# Altium project B100.PrjPcb (part 2 of 3)

## Sheet GSM LED Indicators.SchDoc: GSM Modem Signal Indicator LED's
size A3; ApprovedBy: Mehmet Günce Akkoyun; CheckedBy: Mehmet Günce Akkoyun; Author: Mehmet Günce Akkoyun; CompanyName: Ovoo Electronics; DrawnBy: Mehmet Günce Akkoyun; Engineer: Mehmet Günce Akkoyun; Organization: Ovoo Electronics; Address1: Necip Fazýl Mah. Ortaýrmak Sok.; Address2: Birgül Apt. No: 19/6; Address3: Meram / Konya; Address4: Turkiye; DocumentNumber: 12; Revision: R06; SheetNumber: 12; SheetTotal: 54
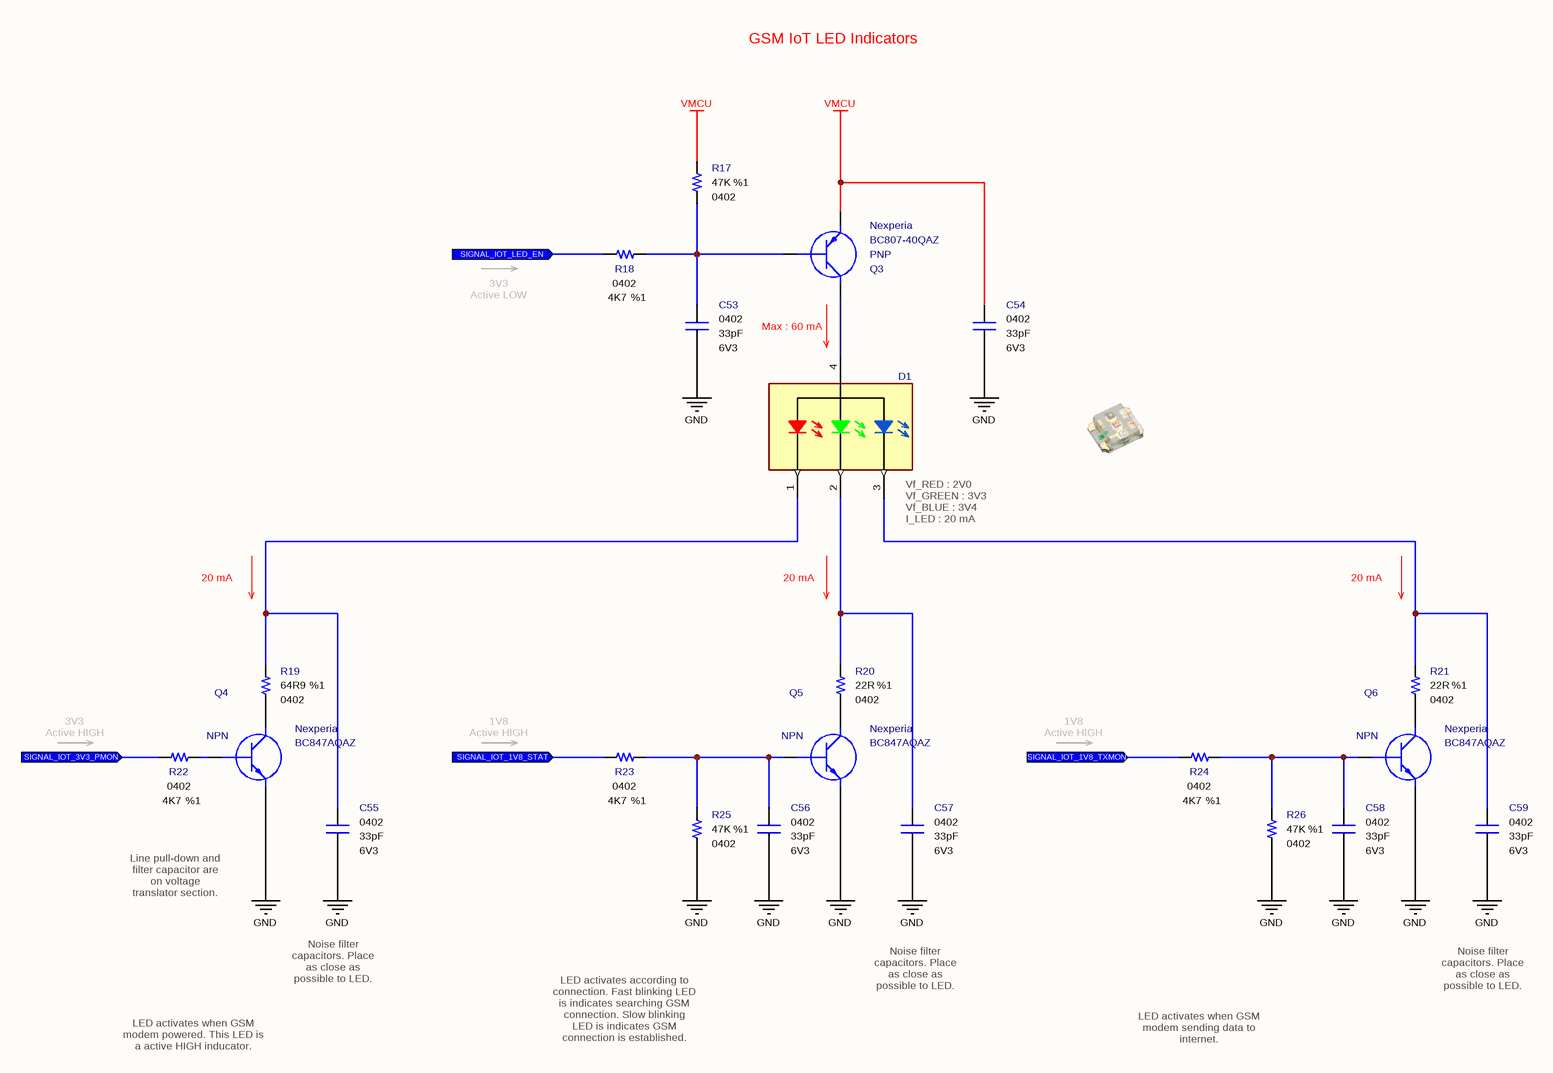
[diagram p9: GSM LED Indicators.SchDoc]

### Parts
C53  value 33pF  Case: 0402  Voltage: 6V3  [CAPACITOR_0402]  (hidden comment: Multilayer Ceramic Capacitor)
C54  value 33pF  Case: 0402  Voltage: 6V3  [CAPACITOR_0402]  (hidden comment: Multilayer Ceramic Capacitor)
C55  value 33pF  Case: 0402  Voltage: 6V3  [CAPACITOR_0402]  (hidden comment: Multilayer Ceramic Capacitor)
C56  value 33pF  Case: 0402  Voltage: 6V3  [CAPACITOR_0402]  (hidden comment: Multilayer Ceramic Capacitor)
C57  value 33pF  Case: 0402  Voltage: 6V3  [CAPACITOR_0402]  (hidden comment: Multilayer Ceramic Capacitor)
C58  value 33pF  Case: 0402  Voltage: 6V3  [CAPACITOR_0402]  (hidden comment: Multilayer Ceramic Capacitor)
C59  value 33pF  Case: 0402  Voltage: 6V3  [CAPACITOR_0402]  (hidden comment: Multilayer Ceramic Capacitor)
D1  150066M153000  [Wurth_0606]  (value not drawn)
Q3  Polarity: PNP  Manufacturer Name: Nexperia  Manufacturer Part Number: BC807-40QAZ  [SOT1215]  (hidden comment: Bipolar PNP Transistors)
Q4  Polarity: NPN  Manufacturer Name: Nexperia  Manufacturer Part Number: BC847AQAZ  [SOT1215]  (hidden comment: Bipolar NPN Transistors)
Q5  Polarity: NPN  Manufacturer Name: Nexperia  Manufacturer Part Number: BC847AQAZ  [SOT1215]  (hidden comment: Bipolar NPN Transistors)
Q6  Polarity: NPN  Manufacturer Name: Nexperia  Manufacturer Part Number: BC847AQAZ  [SOT1215]  (hidden comment: Bipolar NPN Transistors)
R17  value 47K  Tolerance: %1  Case: 0402  [RESISTOR_0402]  (hidden comment: Thick Film Resistor)
R18  value 4K7  Tolerance: %1  Case: 0402  [RESISTOR_0402]  (hidden comment: Thick Film Resistor)
R19  value 64R9  Tolerance: %1  Case: 0402  [RESISTOR_0402]  (hidden comment: Thick Film Resistor)
R20  value 22R  Tolerance: %1  Case: 0402  [RESISTOR_0402]  (hidden comment: Thick Film Resistor)
R21  value 22R  Tolerance: %1  Case: 0402  [RESISTOR_0402]  (hidden comment: Thick Film Resistor)
R22  value 4K7  Tolerance: %1  Case: 0402  [RESISTOR_0402]  (hidden comment: Thick Film Resistor)
R23  value 4K7  Tolerance: %1  Case: 0402  [RESISTOR_0402]  (hidden comment: Thick Film Resistor)
R24  value 4K7  Tolerance: %1  Case: 0402  [RESISTOR_0402]  (hidden comment: Thick Film Resistor)
R25  value 47K  Tolerance: %1  Case: 0402  [RESISTOR_0402]  (hidden comment: Thick Film Resistor)
R26  value 47K  Tolerance: %1  Case: 0402  [RESISTOR_0402]  (hidden comment: Thick Film Resistor)

### Ports
SIGNAL_IOT_1V8_STAT (in), SIGNAL_IOT_1V8_TXMON (in), SIGNAL_IOT_3V3_PMON (in), SIGNAL_IOT_LED_EN (in)

### Nets
GND: C53.2 C54.2 C55.2 C56.2 C57.2 C58.2 C59.2 Q4.2(E) Q5.2(E) Q6.2(E) R25.1 R26.1
VMCU: C54.1 Q3.2(E) R17.2
NetC53_1: C53.1 Q3.1(B) R17.1 R18.1
NetC55_1: C55.1 D1.1 R19.2
NetC56_1: C56.1 Q5.1(B) R23.1 R25.2
NetC57_1: C57.1 D1.2 R20.2
NetC58_1: C58.1 Q6.1(B) R24.1 R26.2
NetC59_1: C59.1 D1.3 R21.2
NetD1_4: D1.4 Q3.3(C)
NetQ4_1: Q4.1(B) R22.1
NetQ4_3: Q4.3(C) R19.1
NetQ5_3: Q5.3(C) R20.1
NetQ6_3: Q6.3(C) R21.1
NetR18_2: R18.2 ; port SIGNAL_IOT_LED_EN
NetR22_2: R22.2 ; port SIGNAL_IOT_3V3_PMON
NetR23_2: R23.2 ; port SIGNAL_IOT_1V8_STAT
NetR24_2: R24.2 ; port SIGNAL_IOT_1V8_TXMON

### Notes on the sheet
- GSM IoT LED Indicators
- 3V3
  Active LOW
- Max : 60 mA
- (near D1) Vf_RED : 2V0
  Vf_GREEN : 3V3
  Vf_BLUE : 3V4
  I_LED : 20 mA
- 20 mA
- 3V3
  Active HIGH
- 1V8
  Active HIGH
- Line pull-down and filter capacitor are on voltage translator section.
- Noise filter capacitors. Place as close as possible to LED.
- LED activates when GSM modem powered. This LED is a active HIGH inducator.
- LED activates according to connection. Fast blinking LED is indicates searching GSM connection. Slow blinking LED is indicates GSM connection is established.
- LED activates when GSM modem sending data to internet.
- Engineer
- All Rights are reserved to Customer and Engineer. [2021]
- Size:
- Date:
- A3
- Project :
- Time:
- Sheet
- of
- Customer
- Product ID
- Module ID
- Version
- File:
- Revision

### Library data of the parts
C53-C59 = Capacitor - 33pF [0402-6V3]: Capacitor - 33pF [0402] (Ceramic); Manufacturer Name: Kemet; Manufacturer Part Number: C0402C330J9RACAUTO; Dielectric: X7R; Tolerance: 10%; Height: 0.5mm; Maximum Operating Temperature: +125; Minimum Operating Temperature: -55; ROHS: Yes; ComponentLink1Description: DataSheet; ComponentLink1URL: https://api.kemet.com/component-edge/download/datasheet/C0402C330J9RACAUTO.pdf; ComponentLink2Description: Mouser; ComponentLink2URL: https://www.mouser.com/Search/Refine.aspx?Keyword=80-C0402C330J9RAUTO; Supplier 1: Mouser; Supplier Part Number 1: 80-C0402C330J9RAUTO; Mouser Part Number: 80-C0402C330J9RAUTO
D1 = Diode - RGB LED (150066M153000): Standard LEDs - SMD PICOLED series Red LED; Manufacturer Name: Wurth Elektronik; Datasheet Link: https://www.mouser.com.tr/datasheet/2/445/150066M153000-1715259.pdf; Manufacturer Part Number: 150066M153000; Mouser Part Number: 710-150066M153000; Mouser Price/Stock: https://www.mouser.com.tr/ProductDetail/ROHM-Semiconductor/SML-P12U2TT86R?qs=sGAEpiMZZMseGfSY3csMkRIBDsfU3UCXJTULB5gem9Ta%252Bp%252BvZ709fg%3D%3D; Case: 0606; ROHS: Yes; Supplier 1: RSComponents; Supplier 2: RSComponents; Supplier 3: Mouser; Supplier 4: Farnell; Supplier 5: Digi-Key; Supplier 6: Digi-Key; Supplier 7: Digi-Key; Supplier 8: Newark; Supplier Part Number 1: 1765006; Supplier Part Number 2: 1766050; Supplier Part Number 3: 710-150066M153000; Supplier Part Number 4: 2764964; Supplier Part Number 5: 732-11390-1-ND; Supplier Part Number 6: 732-11390-6-ND; Supplier Part Number 7: 732-11390-2-ND; Supplier Part Number 8: 22AC3253
Q3 = Transistor - BC807: Bipolar Transistors - BJT 45 V, 500 mA PNP gen purpose transistors; Mouser Part Number: 771-BC807-40QAZ; ComponentLink1Description: DataSheet; ComponentLink1URL: https://www.mouser.com.tr/datasheet/2/916/BC807-25QA_40QA-1665956.pdf; ComponentLink2Description: Mouser; ComponentLink2URL: https://www.mouser.com.tr/ProductDetail/Nexperia/BC807-40QAZ?qs=sGAEpiMZZMshyDBzk1%2FWi8mfWMj7sMzapbI3Mu1S6AqR9y7krhZTdA%3D%3D; Supplier 1: Mouser; Supplier 2: Arrow; Supplier 3: Digi-Key; Supplier 4: Digi-Key; Supplier Part Number 1: 771-BC807-40QAZ; Supplier Part Number 2: BC807-40QAZ; Supplier Part Number 3: 1727-2242-1-ND; Supplier Part Number 4: 1727-2242-6-ND; Case: DFN-1010D-3
Q4-Q6 = Transistor - BC847: Bipolar Transistors - BJT BC847AQA/DFN1010D-3/REEL 7" Q2; ComponentLink1Description: DataSheet; ComponentLink1URL: https://www.mouser.com.tr/datasheet/2/916/BC847XQA_SER-1598405.pdf; ComponentLink2Description: Mouser; ComponentLink2URL: https://www.mouser.com.tr/ProductDetail/Nexperia/BC847AQAZ?qs=%2Fha2pyFaduhKMCPKNtQimeJpXTw9z4AqURd2YARs8DVICZNv3AT9Dw%3D%3D; Case: DFN-1010D-3; Supplier 1: Mouser; Supplier 2: Digi-Key; Supplier Part Number 1: 771-BC847AQAZ; Supplier Part Number 2: 1727-2545-1-ND; Mouser Part Number: 771-BC847AQAZ
R17 R25 R26 = Resistor - 47K: Thick Film Resistors - SMD 1/16 W 47 Kohms 1%; Manufacturer Name: Vishay; Manufacturer Part Number: CRCW040247K0FKED; Height: 0.4mm; ComponentLink1Description: DataSheet; ComponentLink1URL: https://www.mouser.com.tr/datasheet/2/427/dcrcwe3-1762152.pdf; ComponentLink2Description: Mouser; ComponentLink2URL: https://www.mouser.com.tr/ProductDetail/Vishay-Dale/CRCW040247K0FKED?qs=sGAEpiMZZMu61qfTUdNhG2DpbjADlD3GL%252B3h1elTxqU%3D; Supplier 1: Mouser; Supplier 2: Digi-Key; Supplier Part Number 1: 71-CRCW040247K0FKEDH; Supplier Part Number 2: 541-47.0KYCT-ND; Mouser Part Number: 71-CRCW0402-47K-E3
R18 R22-R24 = Resistor - 4K7: Thick Film Resistors - SMD 1/16 W 4.7 Kohms 1%; Manufacturer Name: Vishay; Manufacturer Part Number: CRCW04024K70FKED; Height: 0.4mm; Mouser Part Number: 71-CRCW0402-4.7K-E3; ComponentLink1Description: DataSheet; ComponentLink1URL: https://www.mouser.com.tr/datasheet/2/427/dcrcwe3-1762152.pdf; ComponentLink2Description: Mouser; ComponentLink2URL: https://www.mouser.com.tr/ProductDetail/Vishay-Dale/CRCW04024K70FKED?qs=sGAEpiMZZMu61qfTUdNhG7nHf%2F6MTUn3HadIdDQu24Q%3D; Supplier 1: Mouser; Supplier 2: Digi-Key; Supplier Part Number 2: 541-4.70KLCT-ND; Supplier Part Number 1: 71-CRCW0402-4.7K-E3
R19 = Resistor - 64R9: Thick Film Resistors - SMD 1/16 W 64R9 Ohms 1%; Manufacturer Name: Vishay; Manufacturer Part Number: CRCW040264R9FKED; Height: 0.35mm; Mouser Part Number: 71-CRCW0402-64.9-E3; ComponentLink1Description: DataSheet; ComponentLink1URL: https://www.mouser.com.tr/datasheet/2/427/dcrcwe3-1762152.pdf; ComponentLink2Description: Mouser; ComponentLink2URL: https://www.mouser.com.tr/ProductDetail/Vishay-Dale/CRCW040264R9FKED/?qs=DKbL89i6OErClCPxVYdf6Q%3D%3D; Supplier 1: Future Electronics; Supplier 2: Future Electronics; Supplier 3: Mouser; Supplier 4: Farnell; Supplier 5: Digi-Key; Supplier 6: Digi-Key; Supplier 7: Digi-Key; Supplier 8: Newark; Supplier Part Number 1: 8103763; Supplier Part Number 2: 5785985; Supplier Part Number 3: 71-CRCW0402-64.9-E3; Supplier Part Number 4: 2140657; Supplier Part Number 5: 541-64.9LCT-ND; Supplier Part Number 6: 541-64.9LDKR-ND; Supplier Part Number 7: 541-64.9LTR-ND; Supplier Part Number 8: 27W4015
R20 R21 = Resistor - 22R: Thick Film Resistors - SMD 1/16 W 22R Ohms 1%; Manufacturer Name: Vishay; Manufacturer Part Number: CRCW040222R0FKED; Height: 0.35mm; Mouser Part Number: 71-CRCW0402-22-E3; ComponentLink1Description: DataSheet; ComponentLink1URL: https://www.mouser.com.tr/datasheet/2/427/dcrcwe3-1762152.pdf; ComponentLink2Description: Mouser; ComponentLink2URL: https://www.mouser.com.tr/ProductDetail/Vishay-Dale/CRCW040264R9FKED/?qs=DKbL89i6OErClCPxVYdf6Q%3D%3D; Supplier 1: RSComponents; Supplier 2: Avnet; Supplier 3: RSComponents; Supplier 4: Future Electronics; Supplier 5: Arrow Electronics; Supplier Part Number 1: 6788983; Supplier Part Number 2: 52K6847; Supplier Part Number 3: 6788983P; Supplier Part Number 4: 3103732; Supplier Part Number 5: CRCW040222R0FKED

## Sheet Master MicroController.SchDoc: Master Micro Controller
size A3; ApprovedBy: Mehmet Günce Akkoyun; CheckedBy: Mehmet Günce Akkoyun; Author: Mehmet Günce Akkoyun; CompanyName: Ovoo Electronics; DrawnBy: Mehmet Günce Akkoyun; Engineer: Mehmet Günce Akkoyun; Organization: Ovoo Electronics; Address1: Necip Fazýl Mah. Ortaýrmak Sok.; Address2: Birgül Apt. No: 19/6; Address3: Meram / Konya; Address4: Turkiye; DocumentNumber: 13; Revision: R06; SheetNumber: 13; SheetTotal: 54
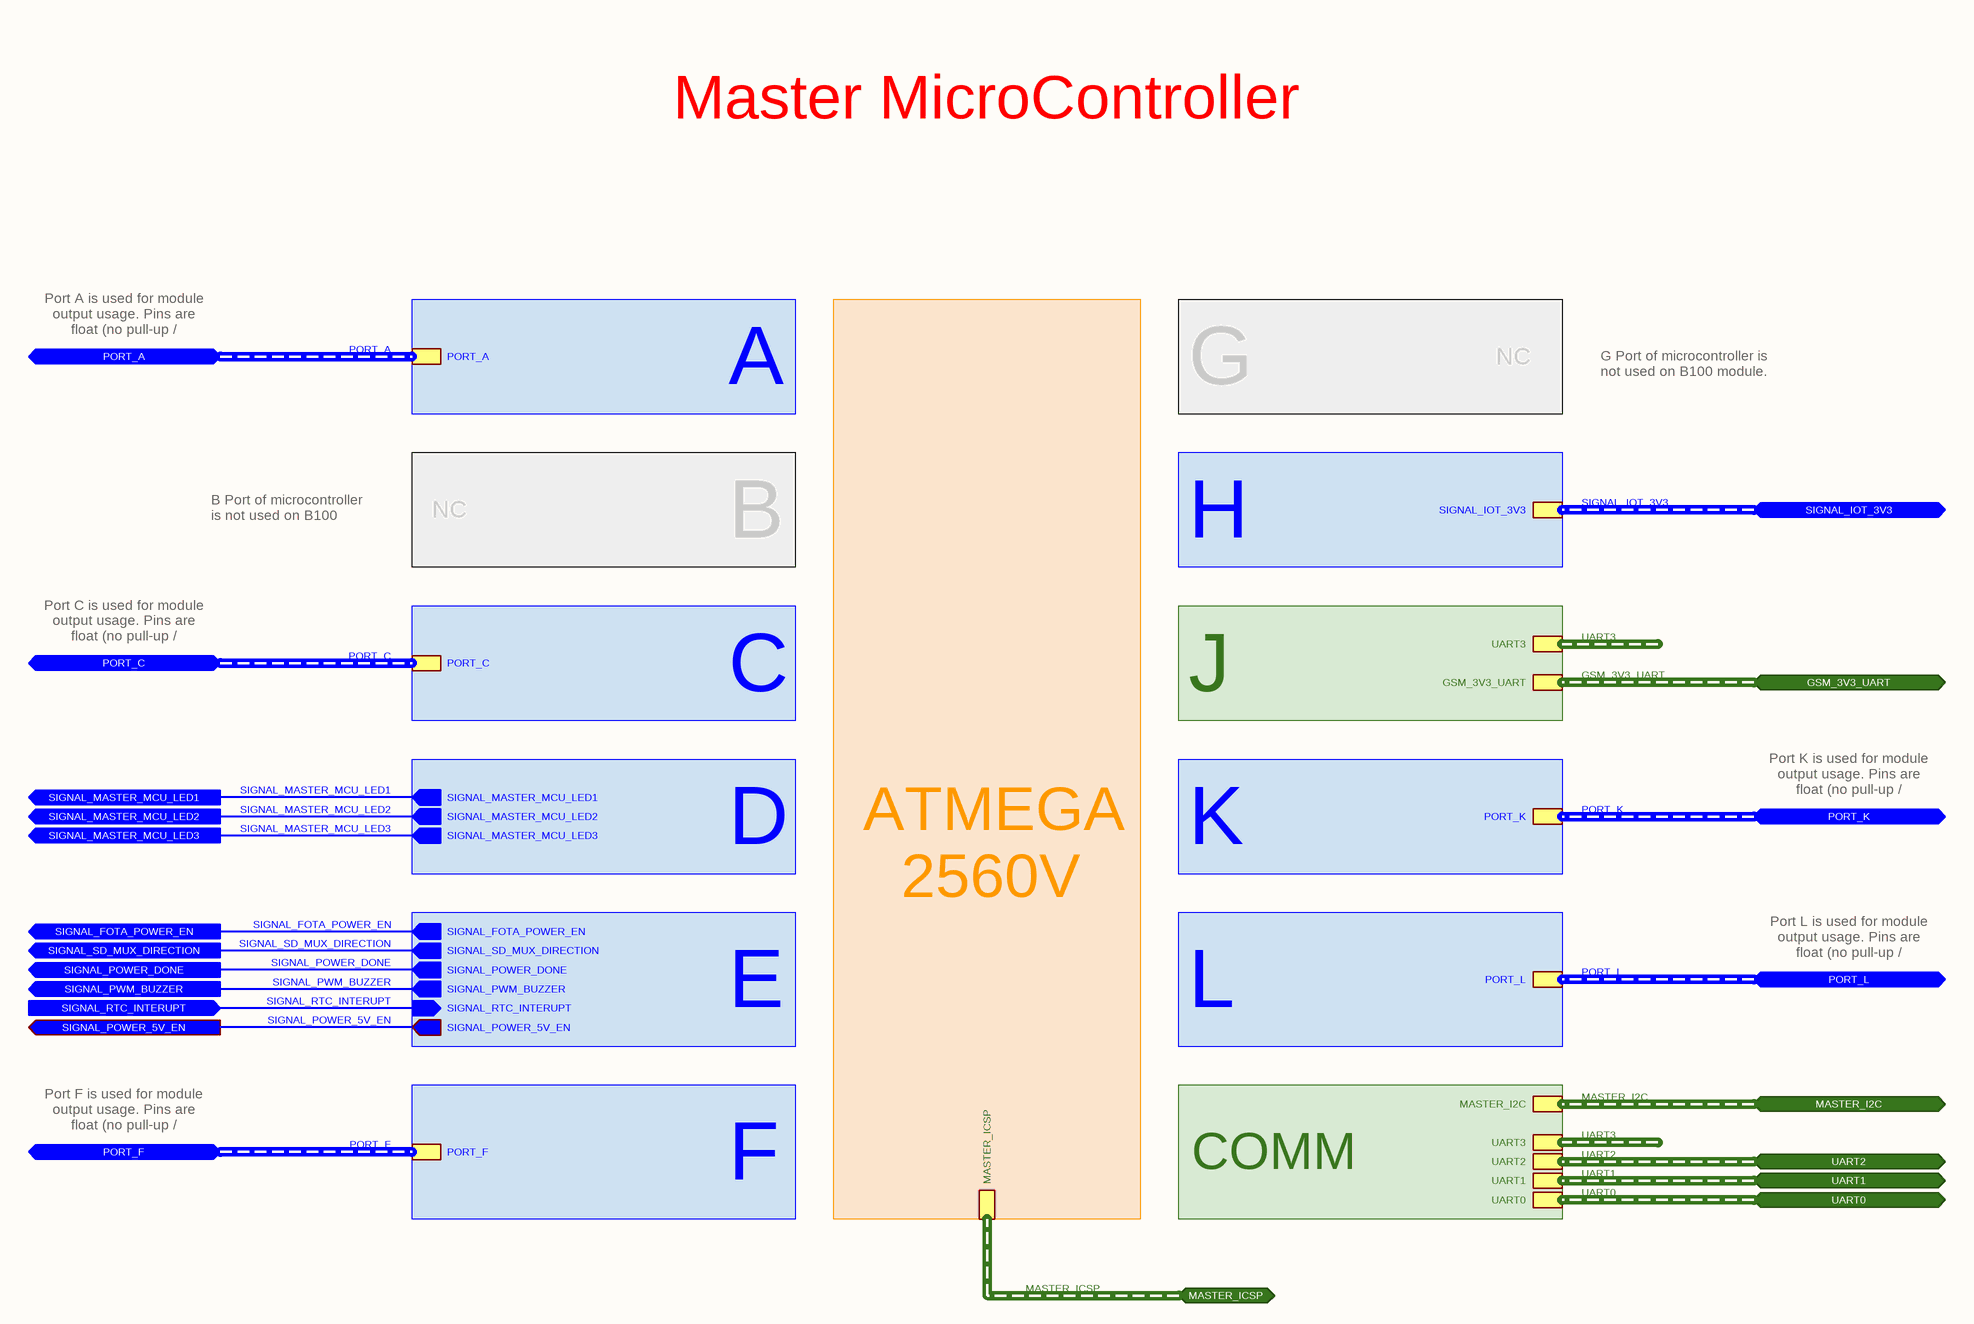
[diagram p10: Master MicroController.SchDoc]

### Sub-sheets
Master MicroController Core = Master MicroController Core.SchDoc: MASTER_ICSP (harness MASTER_ICSP)
PORT A = Master MicroController Port A.SchDoc: PORT_A (harness PORT_A)
PORT B = Master MicroController Port B.SchDoc: no entries
PORT C = Master MicroController Port C.SchDoc: PORT_C (harness PORT_C)
PORT D = Master MicroController Port D.SchDoc (file not in this document): SIGNAL_MASTER_MCU_LED1 (out), SIGNAL_MASTER_MCU_LED3 (out), SIGNAL_MASTER_MCU_LED2 (out)
PORT E = Master MicroController Port E.SchDoc: SIGNAL_FOTA_POWER_EN (out), SIGNAL_SD_MUX_DIRECTION (out), SIGNAL_PWM_BUZZER (out), SIGNAL_RTC_INTERUPT (in), SIGNAL_POWER_DONE (out), SIGNAL_POWER_5V_EN (out)
PORT F = Master MicroController Port F.SchDoc: PORT_F (harness PORT_F)
PORT G = Master MicroController Port G.SchDoc: no entries
PORT H = Master MicroController Port H.SchDoc: SIGNAL_IOT_3V3 (harness SIGNAL_IOT_3V3)
PORT J = Master MicroController Port J.SchDoc (file not in this document): GSM_3V3_UART (harness GSM_3V3_UART), UART3 (harness UART3)
PORT K = Master MicroController Port K.SchDoc: PORT_K (harness PORT_K)
PORT L = Master MicroController Port L.SchDoc (file not in this document): PORT_L (harness PORT_L)
Serial Communication = Master MicroController Serial Communication Port.SchDoc: UART3 (harness UART3), UART1 (harness UART1), UART2 (harness UART2), UART0 (harness UART0), MASTER_I2C (harness MASTER_I2C)

### Ports
GSM_3V3_UART (bidir, harness GSM_3V3_UART), MASTER_I2C (bidir, harness MASTER_I2C), MASTER_ICSP (bidir, harness MASTER_ICSP), PORT_A (bidir, harness PORT_A), PORT_C (bidir, harness PORT_C), PORT_F (bidir, harness PORT_F), PORT_K (bidir, harness PORT_K), PORT_L (bidir, harness PORT_L), SIGNAL_FOTA_POWER_EN (out), SIGNAL_IOT_3V3 (bidir, harness SIGNAL_IOT_3V3), SIGNAL_MASTER_MCU_LED1 (out), SIGNAL_MASTER_MCU_LED2 (out), SIGNAL_MASTER_MCU_LED3 (out), SIGNAL_POWER_5V_EN (out), SIGNAL_POWER_DONE (out), SIGNAL_PWM_BUZZER (out), SIGNAL_RTC_INTERUPT (in), SIGNAL_SD_MUX_DIRECTION (out), UART0 (bidir, harness UART0), UART1 (bidir, harness UART1), UART2 (bidir, harness UART2)

### Nets
SIGNAL_FOTA_POWER_EN: port SIGNAL_FOTA_POWER_EN, sheet PORT E/SIGNAL_FOTA_POWER_EN
SIGNAL_MASTER_MCU_LED1: port SIGNAL_MASTER_MCU_LED1, sheet PORT D/SIGNAL_MASTER_MCU_LED1
SIGNAL_MASTER_MCU_LED2: port SIGNAL_MASTER_MCU_LED2, sheet PORT D/SIGNAL_MASTER_MCU_LED2
SIGNAL_MASTER_MCU_LED3: port SIGNAL_MASTER_MCU_LED3, sheet PORT D/SIGNAL_MASTER_MCU_LED3
SIGNAL_POWER_5V_EN: port SIGNAL_POWER_5V_EN, sheet PORT E/SIGNAL_POWER_5V_EN
SIGNAL_POWER_DONE: port SIGNAL_POWER_DONE, sheet PORT E/SIGNAL_POWER_DONE
SIGNAL_PWM_BUZZER: port SIGNAL_PWM_BUZZER, sheet PORT E/SIGNAL_PWM_BUZZER
SIGNAL_RTC_INTERUPT: port SIGNAL_RTC_INTERUPT, sheet PORT E/SIGNAL_RTC_INTERUPT
SIGNAL_SD_MUX_DIRECTION: port SIGNAL_SD_MUX_DIRECTION, sheet PORT E/SIGNAL_SD_MUX_DIRECTION

### Buses and harness runs
harness GSM_3V3_UART = port GSM_3V3_UART = sheet PORT J/GSM_3V3_UART
harness MASTER_I2C = port MASTER_I2C = sheet Serial Communication/MASTER_I2C
harness MASTER_ICSP = port MASTER_ICSP = sheet Master MicroController Core/MASTER_ICSP
harness PORT_A = port PORT_A = sheet PORT A/PORT_A
harness PORT_C = port PORT_C = sheet PORT C/PORT_C
harness PORT_F = port PORT_F = sheet PORT F/PORT_F
harness PORT_K = port PORT_K = sheet PORT K/PORT_K
harness PORT_L = port PORT_L = sheet PORT L/PORT_L
harness SIGNAL_IOT_3V3 = port SIGNAL_IOT_3V3 = sheet PORT H/SIGNAL_IOT_3V3
harness UART0 = port UART0 = sheet Serial Communication/UART0
harness UART1 = port UART1 = sheet Serial Communication/UART1
harness UART2 = port UART2 = sheet Serial Communication/UART2
harness UART3 = sheet PORT J/UART3
harness UART3 = sheet Serial Communication/UART3

### Notes on the sheet
- Master MicroController
- Port A is used for module output usage. Pins are float (no pull-up / pull-down)
- A
- G
- NC
- G Port of microcontroller is not used on B100 module.
- B Port of microcontroller is not used on B100 module.
- B
- H
- Port C is used for module output usage. Pins are float (no pull-up / pull-down)
- C
- J
- Port K is used for module output usage. Pins are float (no pull-up / pull-down)
- D
- ATMEGA
- 2560V
- K
- Port L is used for module output usage. Pins are float (no pull-up / pull-down)
- E
- L
- Port F is used for module output usage. Pins are float (no pull-up / pull-down)
- F
- COMM
- Engineer
- All Rights are reserved to Customer and Engineer. [2021]
- Size:
- Date:
- A3
- Project :
- Time:
- Sheet
- of
- Customer
- Product ID
- Module ID
- Version
- File:
- Revision

## Sheet Master MicroController Core.SchDoc: Master MicroController Core
size A4; ApprovedBy: Mehmet Günce Akkoyun; CheckedBy: Mehmet Günce Akkoyun; Author: Mehmet Günce Akkoyun; CompanyName: Ovoo Electronics; DrawnBy: Mehmet Günce Akkoyun; Engineer: Mehmet Günce Akkoyun; Organization: Ovoo Electronics; Address1: Necip Fazýl Mah. Ortaýrmak Sok.; Address2: Birgül Apt. No: 19/6; Address3: Meram / Konya; Address4: Turkiye; DocumentNumber: 15; Revision: R06; SheetNumber: 15; SheetTotal: 54
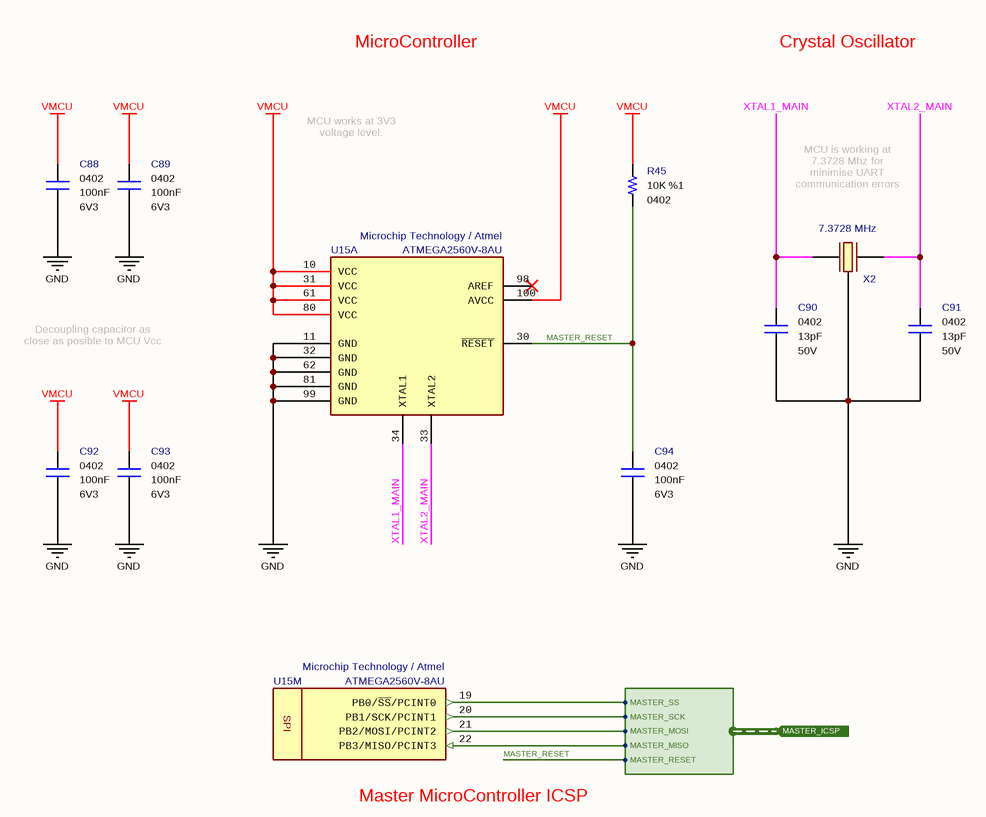
[diagram p11: Master MicroController Core.SchDoc]

### Parts
C88  value 100nF  Case: 0402  Voltage: 6V3  [CAPACITOR_0402]  (hidden comment: Multilayer Ceramic Capacitor)
C89  value 100nF  Case: 0402  Voltage: 6V3  [CAPACITOR_0402]  (hidden comment: Multilayer Ceramic Capacitor)
C90  value 13pF  Voltage: 50V  Case: 0402  [CAPACITOR_0402]  (hidden comment: Multilayer Ceramic Capacitor)
C91  value 13pF  Voltage: 50V  Case: 0402  [CAPACITOR_0402]  (hidden comment: Multilayer Ceramic Capacitor)
C92  value 100nF  Case: 0402  Voltage: 6V3  [CAPACITOR_0402]  (hidden comment: Multilayer Ceramic Capacitor)
C93  value 100nF  Case: 0402  Voltage: 6V3  [CAPACITOR_0402]  (hidden comment: Multilayer Ceramic Capacitor)
C94  value 100nF  Case: 0402  Voltage: 6V3  [CAPACITOR_0402]  (hidden comment: Multilayer Ceramic Capacitor)
R45  value 10K  Tolerance: %1  Case: 0402  [RESISTOR_0402]  (hidden comment: Thick Film Resistor)
U15  Manufacturer Part Number: ATMEGA2560V-8AU  Manufacturer Name: Microchip Technology / Atmel  [TQFP100]  (hidden comment: 8-bit MicroController)  (parts A,M of 15)
X2  7.3728 MHz  [ABRACON_CRYSTAL]

### Ports
MASTER_ICSP (in, harness MASTER_ICSP)

### Harnesses
MASTER_ICSP: MASTER_RESET, MASTER_SCK, MASTER_MISO, MASTER_MOSI, MASTER_SS

### Nets
GND: C88.1 C89.1 C90.1 C91.1 C92.1 C93.1 C94.1 U15.11(GND) U15.32(GND) U15.62(GND) U15.81(GND) U15.99(GND) X2.2(GND)
VMCU: C88.2 C89.2 C92.2 C93.2 R45.2 U15.10(VCC) U15.31(VCC) U15.61(VCC) U15.80(VCC) U15.100(AVCC)
MASTER_ICSP.MASTER_MISO: U15.22(PB3/MISO/PCINT3) ; port MASTER_ICSP.MASTER_MISO
MASTER_ICSP.MASTER_MOSI: U15.21(PB2/MOSI/PCINT2) ; port MASTER_ICSP.MASTER_MOSI
MASTER_ICSP.MASTER_SCK: U15.20(PB1/SCK/PCINT1) ; port MASTER_ICSP.MASTER_SCK
MASTER_ICSP.MASTER_SS: U15.19(PB0/~{SS}/PCINT0) ; port MASTER_ICSP.MASTER_SS
MASTER_RESET: C94.2 R45.1 U15.30(~{RESET}) ; port MASTER_ICSP.MASTER_RESET  [project net MASTER_ICSP.MASTER_RESET]
XTAL1_MAIN: C90.2 U15.34(XTAL1) X2.3(OUT/IN)
XTAL2_MAIN: C91.2 U15.33(XTAL2) X2.1(IN/OUT)

Not connected (* = marked no-connect by the designer): U15 98(AREF)*; X2 4(GND)

### Notes on the sheet
- MicroController
- Crystal Oscillator
- MCU works at 3V3 voltage level.
- MCU is working at 7.3728 Mhz for minimise UART communication errors (115200bps).
- Decoupling capacitor as close as posible to MCU Vcc pins.
- (near U15) Master MicroController ICSP
- Engineer
- All Rights are reserved to Customer and Engineer. [2021]
- Size:
- Date:
- A4
- Project :
- Time:
- Sheet
- of
- Customer
- Product ID
- Module ID
- Version
- File:
- Revision
- (in symbol IC - ATMEGA2560V-8AU, part M) SPI

### Library data of the parts
C88 C89 C92-C94 = Capacitor - 100nF [0402-6V3]: Capacitor - 100nF [0402-6V3] (Ceramic); Manufacturer Name: AVX; Manufacturer Part Number: 04026D104KAT4A; Dielectric: X5R; Tolerance: %10; Height: 0.25mm; ComponentLink1Description: Mouser; ComponentLink1URL: https://www.mouser.com.tr/ProductDetail/AVX/04026D104KAT4A?qs=sGAEpiMZZMs0AnBnWHyRQPg4iYkCw7IMED%2F4kpqgf7w%3D; ComponentLink2Description: DataSheet; ComponentLink2URL: https://www.mouser.com.tr/datasheet/2/40/cx5r-776519.pdf; ROHS: Yes; Maximum Operating Temperature: +85; Minimum Operating Temperature: -55; Supplier 1: Avnet; Supplier Part Number 1: 04026D104KAT4A; Mouser Part Number: 581-04026D104KAT4A
C90 C91 = Capacitor - 13pF [0402-50V]: Capacitor - 13pF [0402] (Ceramic); Manufacturer Name: Kemet; Manufacturer Part Number: CBR04C130F5GAC; Dielectric: C0G; Tolerance: 1%; Height: 0.55mm; ROHS: Yes; Weight: 0.65mg; ComponentLink1Description: DataSheet; ComponentLink1URL: http://www.kemet.com/Lists/ProductCatalog/Attachments/490/KEM_C1030_CBR_SMD.pdf; ComponentLink2Description: Mouser; ComponentLink2URL: http://www.mouser.com/Search/ProductDetail.aspx?qs=kSX8PZDGYstn%252bRHasf81FA%3d%3d; Supplier 1: Mouser; Supplier 2: Farnell; Supplier 3: Digi-Key; Supplier Part Number 3: 399-8812-1-ND; Supplier Part Number 2: 2773390; Supplier Part Number 1: 80-CBR04C130F5GAC; Mouser Part Number: 80-CBR04C130F5GAC
R45 = Resistor - 10K: Thick Film Resistors - SMD 1/16 W 10 Kohms 1%; Manufacturer Name: Vishay; Manufacturer Part Number: CRCW040210K0FKED; Height: 0.4mm; ComponentLink1Description: DataSheet; ComponentLink1URL: https://www.mouser.com.tr/datasheet/2/427/dcrcwe3-1762152.pdf; ComponentLink2Description: Mouser; ComponentLink2URL: https://www.mouser.com.tr/ProductDetail/Vishay-Dale/CRCW040210K0FKED?qs=sGAEpiMZZMu61qfTUdNhG2DpbjADlD3GcalbOv9utCY%3D; Supplier 1: Mouser; Supplier 2: Digi-Key; Supplier Part Number 1: 71-CRCW040210K0FKEDH; Supplier Part Number 2: 541-10.0KYCT-ND; Mouser Part Number: 71-CRCW0402-10K-E3
U15 = IC - ATMEGA2560V-8AU: 8-bit Microcontrollers - MCU 256kB Flash 4kB EEPROM 86 I/O Pins; Supply Voltage - Min: 2V7; Supply Voltage - Max: 5.5V; Height: 1mm; ComponentLink1Description: DataSheet; ComponentLink1URL: https://eu.mouser.com/datasheet/2/268/Atmel-2549-8-bit-AVR-Microcontroller-ATmega640-128-1315286.pdf; ROHS: Yes; Minimum Operating Temperature: -40; Maximum Operating Temperature: +85; ComponentLink2Description: Mouser; ComponentLink2URL: https://eu.mouser.com/ProductDetail/Microchip-Technology-Atmel/ATMEGA2560V-8AU?qs=sGAEpiMZZMutXGli8Ay4kKlCYcvZUWqJYdtgGFyqFT8%3D; Supplier 1: Mouser; Supplier 2: Arrow; Supplier 3: Farnell; Supplier 4: Newark; Supplier 5: Digi-Key; Supplier Part Number 1: 556-ATMEGA2560V8AU; Supplier Part Number 2: ATMEGA2560V-8AU; Supplier Part Number 3: 1288331; Supplier Part Number 4: 68T2784; Supplier Part Number 5: ATMEGA2560V-8AU-ND; Case: TQFP-100; Mouser Part Number: 556-ATMEGA2560V8AU
X2 = Crystal - 7.3728 MHz (Abracon): Crystals 7.3728MHz 18pF -40C +85C; Manufacturer Part Number: ABMM2-7.3728MHZ-E2-T; ESR: 150 Ohms; Frequency Stability: 20 ppm; Height: 1.2 mm; Manufacturer Name: ABRACON; Mouser Part Number: 815-ABMM2-7.3-E2-T; Frequency: 7.3728 MHz; Maximum Operating Temperature: +70; Minimum Operating Temperature: -20; ROHS: Yes; Tolerance: 20 ppm; ComponentLink1Description: DataSheet; ComponentLink1URL: https://www.ecsxtal.com/store/pdf/csm-8mr.pdf; ComponentLink2Description: Mouser; ComponentLink2URL: https://www.mouser.com/Search/Refine.aspx?Keyword=520-7.3-18-20BM-JENT; Supplier 1: Mouser; Supplier 2: Arrow; Supplier Part Number 2: ABMM2-7.3728MHZ-E2-T; Supplier Part Number 1: 815-ABMM2-7.3-E2-T; Case: SMD

## Sheet Master MicroController Port A.SchDoc: Master Micro Controller Port A Pin Out
size A4; ApprovedBy: Mehmet Günce Akkoyun; CheckedBy: Mehmet Günce Akkoyun; Author: Mehmet Günce Akkoyun; CompanyName: Ovoo Electronics; DrawnBy: Mehmet Günce Akkoyun; Engineer: Mehmet Günce Akkoyun; Organization: Ovoo Electronics; Address1: Necip Fazýl Mah. Ortaýrmak Sok.; Address2: Birgül Apt. No: 19/6; Address3: Meram / Konya; Address4: Turkiye; DocumentNumber: 16; Revision: R06; SheetNumber: 16; SheetTotal: 54
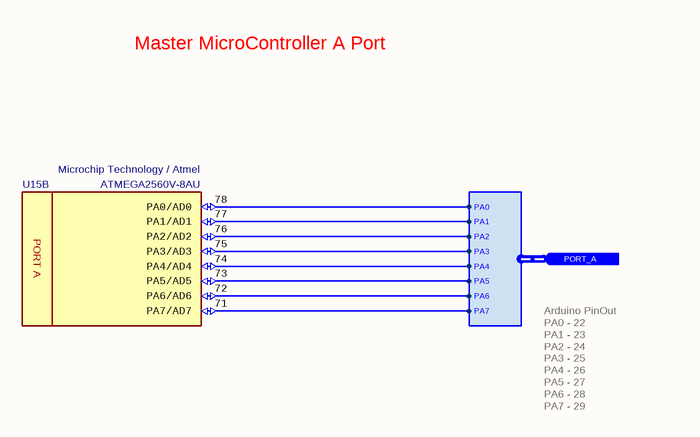
[diagram p12: Master MicroController Port A.SchDoc]

### Parts
U15  Manufacturer_Part_Number: ATMEGA2560V-8AU  Manufacturer_Name: Microchip Technology / Atmel  [TQFP100]  (hidden comment: 8-bit MicroController)  (part B of 15)

### Ports
PORT_A (in, harness PORT_A)

### Harnesses
PORT_A: PA0, PA1, PA2, PA3, PA4, PA5, PA7, PA6

### Nets
PORT_A.PA0: U15.78(PA0/AD0) ; port PORT_A.PA0
PORT_A.PA1: U15.77(PA1/AD1) ; port PORT_A.PA1
PORT_A.PA2: U15.76(PA2/AD2) ; port PORT_A.PA2
PORT_A.PA3: U15.75(PA3/AD3) ; port PORT_A.PA3
PORT_A.PA4: U15.74(PA4/AD4) ; port PORT_A.PA4
PORT_A.PA5: U15.73(PA5/AD5) ; port PORT_A.PA5
PORT_A.PA6: U15.72(PA6/AD6) ; port PORT_A.PA6
PORT_A.PA7: U15.71(PA7/AD7) ; port PORT_A.PA7

### Notes on the sheet
- Master MicroController A Port
- Arduino PinOut
  PA0 - 22
  PA1 - 23
  PA2 - 24
  PA3 - 25
  PA4 - 26
  PA5 - 27
  PA6 - 28
  PA7 - 29
- Engineer
- All Rights are reserved to Customer and Engineer. [2021]
- Size:
- Date:
- A4
- Project :
- Time:
- Sheet
- of
- Customer
- Product ID
- Module ID
- Version
- File:
- Revision
- (in symbol IC - ATMEGA2560V-8AU, part B) PORT A

### Library data of the parts
U15 = IC - ATMEGA2560V-8AU: as U15 on sheet Master MicroController Core; Height: 1mm; Mouser_Part_Number: 556-ATMEGA2560V8AU; ComponentLink1Description: DataSheet; ComponentLink1URL: https://eu.mouser.com/datasheet/2/268/Atmel-2549-8-bit-AVR-Microcontroller-ATmega640-128-1315286.pdf; ROHS: Yes; Minimum Operating Temperature: -40; Maximum Operating Temperature: +85; ComponentLink2Description: Mouser; ComponentLink2URL: https://eu.mouser.com/ProductDetail/Microchip-Technology-Atmel/ATMEGA2560V-8AU?qs=sGAEpiMZZMutXGli8Ay4kKlCYcvZUWqJYdtgGFyqFT8%3D; Supplier 1: Mouser; Supplier 2: Arrow; Supplier 3: Farnell; Supplier 4: Newark; Supplier 5: Digi-Key; Supplier Part Number 1: 556-ATMEGA2560V8AU; Supplier Part Number 2: ATMEGA2560V-8AU; Supplier Part Number 3: 1288331; Supplier Part Number 4: 68T2784; Supplier Part Number 5: ATMEGA2560V-8AU-ND; Case: TQFP-100

## Sheet Master MicroController Port B.SchDoc: Master Micro Controller Port B Pin Out
size A4; ApprovedBy: Mehmet Günce Akkoyun; CheckedBy: Mehmet Günce Akkoyun; Author: Mehmet Günce Akkoyun; CompanyName: Ovoo Electronics; DrawnBy: Mehmet Günce Akkoyun; Engineer: Mehmet Günce Akkoyun; Organization: Ovoo Electronics; Address1: Necip Fazýl Mah. Ortaýrmak Sok.; Address2: Birgül Apt. No: 19/6; Address3: Meram / Konya; Address4: Turkiye; DocumentNumber: 17; Revision: R06; SheetNumber: 17; SheetTotal: 54
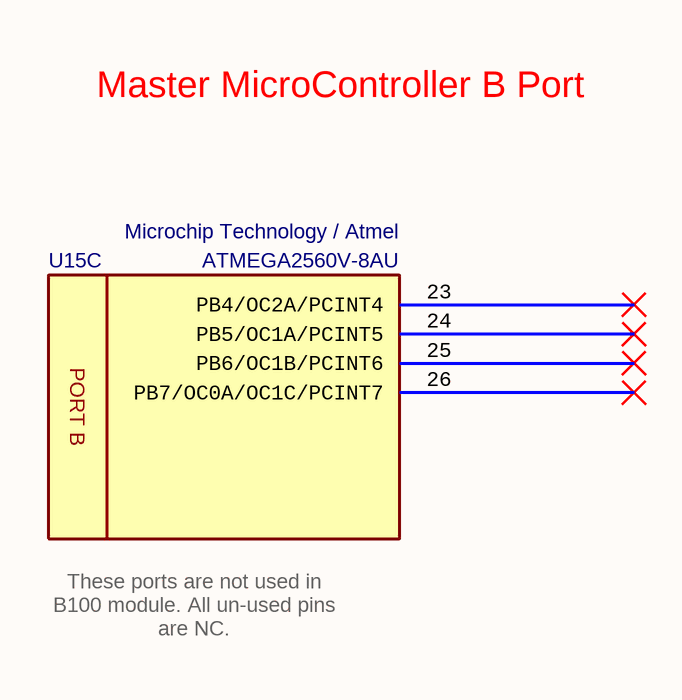
[diagram p13: Master MicroController Port B.SchDoc]

### Parts
U15  Manufacturer_Part_Number: ATMEGA2560V-8AU  Manufacturer_Name: Microchip Technology / Atmel  [TQFP100]  (hidden comment: 8-bit MicroController)  (part C of 15)

### Nets

Not connected (* = marked no-connect by the designer): U15 23(PB4/OC2A/PCINT4)* 24(PB5/OC1A/PCINT5)* 25(PB6/OC1B/PCINT6)* 26(PB7/OC0A/OC1C/PCINT7)*

### Notes on the sheet
- Master MicroController B Port
- These ports are not used in B100 module. All un-used pins are NC.
- Engineer
- All Rights are reserved to Customer and Engineer. [2021]
- Size:
- Date:
- A4
- Project :
- Time:
- Sheet
- of
- Customer
- Product ID
- Module ID
- Version
- File:
- Revision
- (in symbol IC - ATMEGA2560V-8AU, part C) PORT B

### Library data of the parts
U15 = IC - ATMEGA2560V-8AU: as U15 on sheet Master MicroController Core; Height: 1mm; Mouser_Part_Number: 556-ATMEGA2560V8AU; ComponentLink1Description: DataSheet; ComponentLink1URL: https://eu.mouser.com/datasheet/2/268/Atmel-2549-8-bit-AVR-Microcontroller-ATmega640-128-1315286.pdf; ROHS: Yes; Minimum Operating Temperature: -40; Maximum Operating Temperature: +85; ComponentLink2Description: Mouser; ComponentLink2URL: https://eu.mouser.com/ProductDetail/Microchip-Technology-Atmel/ATMEGA2560V-8AU?qs=sGAEpiMZZMutXGli8Ay4kKlCYcvZUWqJYdtgGFyqFT8%3D; Supplier 1: Mouser; Supplier 2: Arrow; Supplier 3: Farnell; Supplier 4: Newark; Supplier 5: Digi-Key; Supplier Part Number 1: 556-ATMEGA2560V8AU; Supplier Part Number 2: ATMEGA2560V-8AU; Supplier Part Number 3: 1288331; Supplier Part Number 4: 68T2784; Supplier Part Number 5: ATMEGA2560V-8AU-ND; Case: TQFP-100

## Sheet Master MicroController Port C.SchDoc: Master Micro Controller Port C Pin Out
size A4; ApprovedBy: Mehmet Günce Akkoyun; CheckedBy: Mehmet Günce Akkoyun; Author: Mehmet Günce Akkoyun; CompanyName: Ovoo Electronics; DrawnBy: Mehmet Günce Akkoyun; Engineer: Mehmet Günce Akkoyun; Organization: Ovoo Electronics; Address1: Necip Fazýl Mah. Ortaýrmak Sok.; Address2: Birgül Apt. No: 19/6; Address3: Meram / Konya; Address4: Turkiye; DocumentNumber: 18; Revision: R06; SheetNumber: 18; SheetTotal: 54
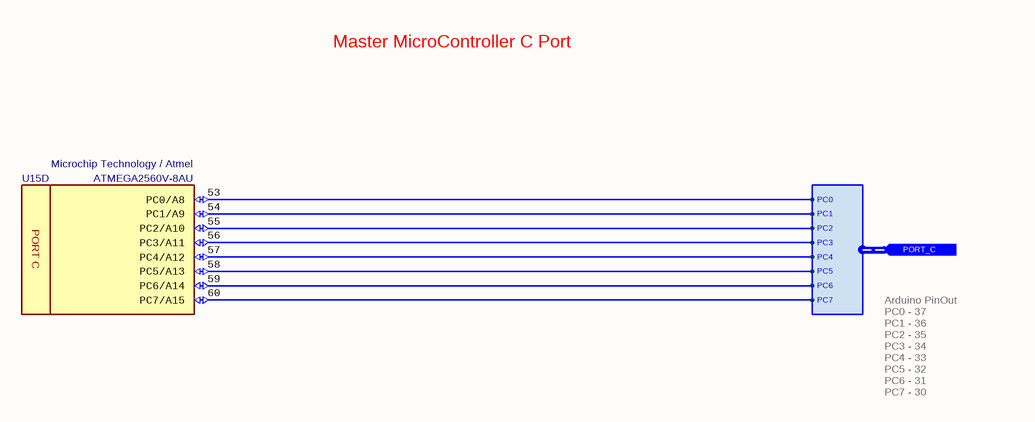
[diagram p14: Master MicroController Port C.SchDoc]

### Parts
U15  Manufacturer_Part_Number: ATMEGA2560V-8AU  Manufacturer_Name: Microchip Technology / Atmel  [TQFP100]  (hidden comment: 8-bit MicroController)  (part D of 15)

### Ports
PORT_C (in, harness PORT_C)

### Harnesses
PORT_C: PC0, PC1, PC2, PC3, PC4, PC5, PC7, PC6

### Nets
PORT_C.PC0: U15.53(PC0/A8) ; port PORT_C.PC0
PORT_C.PC1: U15.54(PC1/A9) ; port PORT_C.PC1
PORT_C.PC2: U15.55(PC2/A10) ; port PORT_C.PC2
PORT_C.PC3: U15.56(PC3/A11) ; port PORT_C.PC3
PORT_C.PC4: U15.57(PC4/A12) ; port PORT_C.PC4
PORT_C.PC5: U15.58(PC5/A13) ; port PORT_C.PC5
PORT_C.PC6: U15.59(PC6/A14) ; port PORT_C.PC6
PORT_C.PC7: U15.60(PC7/A15) ; port PORT_C.PC7

### Notes on the sheet
- Master MicroController C Port
- Arduino PinOut
  PC0 - 37
  PC1 - 36
  PC2 - 35
  PC3 - 34
  PC4 - 33
  PC5 - 32
  PC6 - 31
  PC7 - 30
- Engineer
- All Rights are reserved to Customer and Engineer. [2021]
- Size:
- Date:
- A4
- Project :
- Time:
- Sheet
- of
- Customer
- Product ID
- Module ID
- Version
- File:
- Revision
- (in symbol IC - ATMEGA2560V-8AU, part D) PORT C

### Library data of the parts
U15 = IC - ATMEGA2560V-8AU: as U15 on sheet Master MicroController Core; Height: 1mm; Mouser_Part_Number: 556-ATMEGA2560V8AU; ComponentLink1Description: DataSheet; ComponentLink1URL: https://eu.mouser.com/datasheet/2/268/Atmel-2549-8-bit-AVR-Microcontroller-ATmega640-128-1315286.pdf; ROHS: Yes; Minimum Operating Temperature: -40; Maximum Operating Temperature: +85; ComponentLink2Description: Mouser; ComponentLink2URL: https://eu.mouser.com/ProductDetail/Microchip-Technology-Atmel/ATMEGA2560V-8AU?qs=sGAEpiMZZMutXGli8Ay4kKlCYcvZUWqJYdtgGFyqFT8%3D; Supplier 1: Mouser; Supplier 2: Arrow; Supplier 3: Farnell; Supplier 4: Newark; Supplier 5: Digi-Key; Supplier Part Number 1: 556-ATMEGA2560V8AU; Supplier Part Number 2: ATMEGA2560V-8AU; Supplier Part Number 3: 1288331; Supplier Part Number 4: 68T2784; Supplier Part Number 5: ATMEGA2560V-8AU-ND; Case: TQFP-100

## Sheet Master MicroController Port E.SchDoc: Master Micro Controller Port E Pin Out
size A4; ApprovedBy: Mehmet Günce Akkoyun; CheckedBy: Mehmet Günce Akkoyun; Author: Mehmet Günce Akkoyun; CompanyName: Ovoo Electronics; DrawnBy: Mehmet Günce Akkoyun; Engineer: Mehmet Günce Akkoyun; Organization: Ovoo Electronics; Address1: Necip Fazýl Mah. Ortaýrmak Sok.; Address2: Birgül Apt. No: 19/6; Address3: Meram / Konya; Address4: Turkiye; DocumentNumber: 20; Revision: R06; SheetNumber: 20; SheetTotal: 54
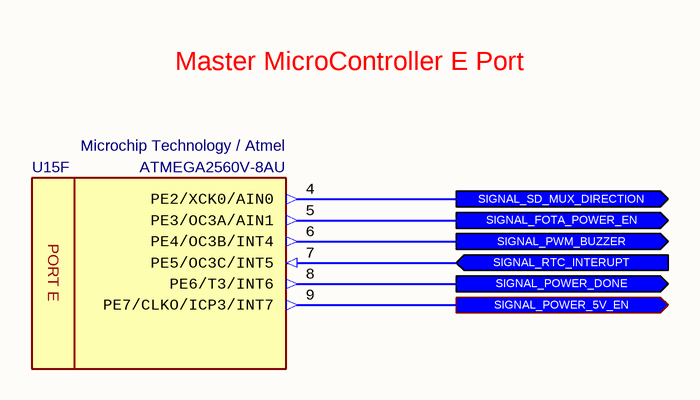
[diagram p15: Master MicroController Port E.SchDoc]

### Parts
U15  Manufacturer_Part_Number: ATMEGA2560V-8AU  Manufacturer_Name: Microchip Technology / Atmel  [TQFP100]  (hidden comment: 8-bit MicroController)  (part F of 15)

### Ports
SIGNAL_FOTA_POWER_EN (out), SIGNAL_POWER_5V_EN (out), SIGNAL_POWER_DONE (out), SIGNAL_PWM_BUZZER (out), SIGNAL_RTC_INTERUPT (in), SIGNAL_SD_MUX_DIRECTION (out)

### Nets
SIGNAL_FOTA_POWER_EN: U15.5(PE3/OC3A/AIN1) ; port SIGNAL_FOTA_POWER_EN
SIGNAL_POWER_5V_EN: U15.9(PE7/CLKO/ICP3/INT7) ; port SIGNAL_POWER_5V_EN
SIGNAL_POWER_DONE: U15.8(PE6/T3/INT6) ; port SIGNAL_POWER_DONE
SIGNAL_PWM_BUZZER: U15.6(PE4/OC3B/INT4) ; port SIGNAL_PWM_BUZZER
SIGNAL_RTC_INTERUPT: U15.7(PE5/OC3C/INT5) ; port SIGNAL_RTC_INTERUPT
SIGNAL_SD_MUX_DIRECTION: U15.4(PE2/XCK0/AIN0) ; port SIGNAL_SD_MUX_DIRECTION

### Notes on the sheet
- Master MicroController E Port
- Engineer
- All Rights are reserved to Customer and Engineer. [2021]
- Size:
- Date:
- A4
- Project :
- Time:
- Sheet
- of
- Customer
- Product ID
- Module ID
- Version
- File:
- Revision
- (in symbol IC - ATMEGA2560V-8AU, part F) PORT E

### Library data of the parts
U15 = IC - ATMEGA2560V-8AU: as U15 on sheet Master MicroController Core; Height: 1mm; Mouser_Part_Number: 556-ATMEGA2560V8AU; ComponentLink1Description: DataSheet; ComponentLink1URL: https://eu.mouser.com/datasheet/2/268/Atmel-2549-8-bit-AVR-Microcontroller-ATmega640-128-1315286.pdf; ROHS: Yes; Minimum Operating Temperature: -40; Maximum Operating Temperature: +85; ComponentLink2Description: Mouser; ComponentLink2URL: https://eu.mouser.com/ProductDetail/Microchip-Technology-Atmel/ATMEGA2560V-8AU?qs=sGAEpiMZZMutXGli8Ay4kKlCYcvZUWqJYdtgGFyqFT8%3D; Supplier 1: Mouser; Supplier 2: Arrow; Supplier 3: Farnell; Supplier 4: Newark; Supplier 5: Digi-Key; Supplier Part Number 1: 556-ATMEGA2560V8AU; Supplier Part Number 2: ATMEGA2560V-8AU; Supplier Part Number 3: 1288331; Supplier Part Number 4: 68T2784; Supplier Part Number 5: ATMEGA2560V-8AU-ND; Case: TQFP-100

## Sheet Master MicroController Port F.SchDoc: Master Micro Controller Port F Pin Out
size A4; ApprovedBy: Mehmet Günce Akkoyun; CheckedBy: Mehmet Günce Akkoyun; Author: Mehmet Günce Akkoyun; CompanyName: Ovoo Electronics; DrawnBy: Mehmet Günce Akkoyun; Engineer: Mehmet Günce Akkoyun; Organization: Ovoo Electronics; Address1: Necip Fazýl Mah. Ortaýrmak Sok.; Address2: Birgül Apt. No: 19/6; Address3: Meram / Konya; Address4: Turkiye; DocumentNumber: 21; Revision: R06; SheetNumber: 21; SheetTotal: 54
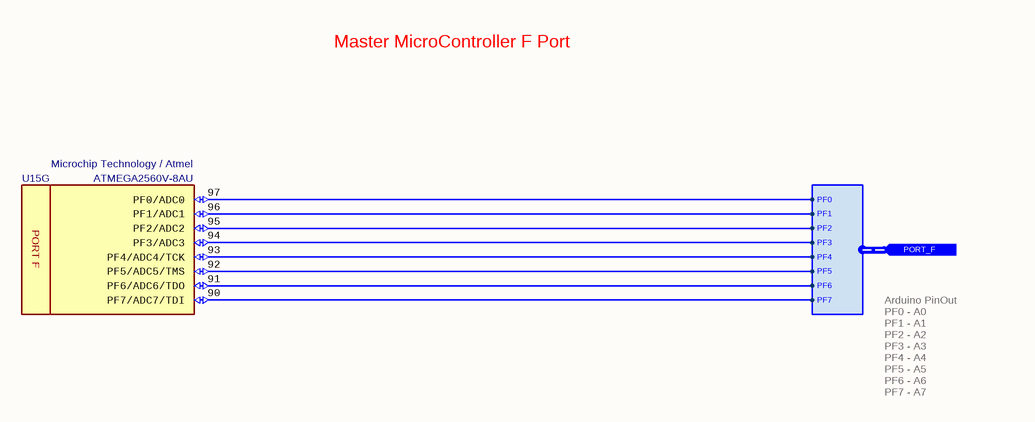
[diagram p16: Master MicroController Port F.SchDoc]

### Parts
U15  Manufacturer_Part_Number: ATMEGA2560V-8AU  Manufacturer_Name: Microchip Technology / Atmel  [TQFP100]  (hidden comment: 8-bit MicroController)  (part G of 15)

### Ports
PORT_F (in, harness PORT_F)

### Harnesses
PORT_F: PF0, PF1, PF2, PF3, PF4, PF5, PF7, PF6

### Nets
PORT_F.PF0: U15.97(PF0/ADC0) ; port PORT_F.PF0
PORT_F.PF1: U15.96(PF1/ADC1) ; port PORT_F.PF1
PORT_F.PF2: U15.95(PF2/ADC2) ; port PORT_F.PF2
PORT_F.PF3: U15.94(PF3/ADC3) ; port PORT_F.PF3
PORT_F.PF4: U15.93(PF4/ADC4/TCK) ; port PORT_F.PF4
PORT_F.PF5: U15.92(PF5/ADC5/TMS) ; port PORT_F.PF5
PORT_F.PF6: U15.91(PF6/ADC6/TDO) ; port PORT_F.PF6
PORT_F.PF7: U15.90(PF7/ADC7/TDI) ; port PORT_F.PF7

### Notes on the sheet
- Master MicroController F Port
- Arduino PinOut
  PF0 - A0
  PF1 - A1
  PF2 - A2
  PF3 - A3
  PF4 - A4
  PF5 - A5
  PF6 - A6
  PF7 - A7
- Engineer
- All Rights are reserved to Customer and Engineer. [2021]
- Size:
- Date:
- A4
- Project :
- Time:
- Sheet
- of
- Customer
- Product ID
- Module ID
- Version
- File:
- Revision
- (in symbol IC - ATMEGA2560V-8AU, part G) PORT F

### Library data of the parts
U15 = IC - ATMEGA2560V-8AU: as U15 on sheet Master MicroController Core; Height: 1mm; Mouser_Part_Number: 556-ATMEGA2560V8AU; ComponentLink1Description: DataSheet; ComponentLink1URL: https://eu.mouser.com/datasheet/2/268/Atmel-2549-8-bit-AVR-Microcontroller-ATmega640-128-1315286.pdf; ROHS: Yes; Minimum Operating Temperature: -40; Maximum Operating Temperature: +85; ComponentLink2Description: Mouser; ComponentLink2URL: https://eu.mouser.com/ProductDetail/Microchip-Technology-Atmel/ATMEGA2560V-8AU?qs=sGAEpiMZZMutXGli8Ay4kKlCYcvZUWqJYdtgGFyqFT8%3D; Supplier 1: Mouser; Supplier 2: Arrow; Supplier 3: Farnell; Supplier 4: Newark; Supplier 5: Digi-Key; Supplier Part Number 1: 556-ATMEGA2560V8AU; Supplier Part Number 2: ATMEGA2560V-8AU; Supplier Part Number 3: 1288331; Supplier Part Number 4: 68T2784; Supplier Part Number 5: ATMEGA2560V-8AU-ND; Case: TQFP-100

## Sheet Master MicroController Port G.SchDoc: Master Micro Controller Port G Pin Out
size A4; ApprovedBy: Mehmet Günce Akkoyun; CheckedBy: Mehmet Günce Akkoyun; Author: Mehmet Günce Akkoyun; CompanyName: Ovoo Electronics; DrawnBy: Mehmet Günce Akkoyun; Engineer: Mehmet Günce Akkoyun; Organization: Ovoo Electronics; Address1: Necip Fazýl Mah. Ortaýrmak Sok.; Address2: Birgül Apt. No: 19/6; Address3: Meram / Konya; Address4: Turkiye; DocumentNumber: 22; Revision: R06; SheetNumber: 22; SheetTotal: 54
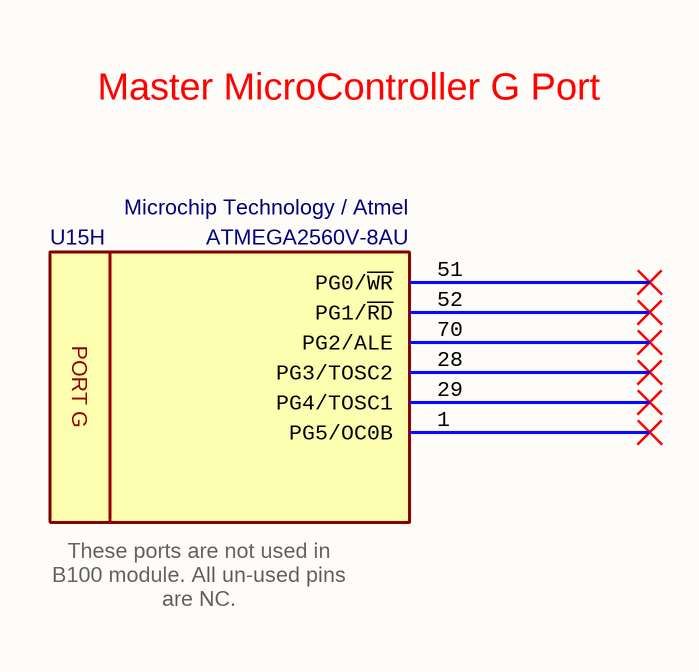
[diagram p17: Master MicroController Port G.SchDoc]

### Parts
U15  Manufacturer_Part_Number: ATMEGA2560V-8AU  Manufacturer_Name: Microchip Technology / Atmel  [TQFP100]  (hidden comment: 8-bit MicroController)  (part H of 15)

### Nets

Not connected (* = marked no-connect by the designer): U15 1(PG5/OC0B)* 28(PG3/TOSC2)* 29(PG4/TOSC1)* 51(PG0/~{WR})* 52(PG1/~{RD})* 70(PG2/ALE)*

### Notes on the sheet
- Master MicroController G Port
- These ports are not used in B100 module. All un-used pins are NC.
- Engineer
- All Rights are reserved to Customer and Engineer. [2021]
- Size:
- Date:
- A4
- Project :
- Time:
- Sheet
- of
- Customer
- Product ID
- Module ID
- Version
- File:
- Revision
- (in symbol IC - ATMEGA2560V-8AU, part H) PORT G

### Library data of the parts
U15 = IC - ATMEGA2560V-8AU: as U15 on sheet Master MicroController Core; Height: 1mm; Mouser_Part_Number: 556-ATMEGA2560V8AU; ComponentLink1Description: DataSheet; ComponentLink1URL: https://eu.mouser.com/datasheet/2/268/Atmel-2549-8-bit-AVR-Microcontroller-ATmega640-128-1315286.pdf; ROHS: Yes; Minimum Operating Temperature: -40; Maximum Operating Temperature: +85; ComponentLink2Description: Mouser; ComponentLink2URL: https://eu.mouser.com/ProductDetail/Microchip-Technology-Atmel/ATMEGA2560V-8AU?qs=sGAEpiMZZMutXGli8Ay4kKlCYcvZUWqJYdtgGFyqFT8%3D; Supplier 1: Mouser; Supplier 2: Arrow; Supplier 3: Farnell; Supplier 4: Newark; Supplier 5: Digi-Key; Supplier Part Number 1: 556-ATMEGA2560V8AU; Supplier Part Number 2: ATMEGA2560V-8AU; Supplier Part Number 3: 1288331; Supplier Part Number 4: 68T2784; Supplier Part Number 5: ATMEGA2560V-8AU-ND; Case: TQFP-100

## Sheet Master MicroController Port H.SchDoc: Master Micro Controller Port H Pin Out
size A4; ApprovedBy: Mehmet Günce Akkoyun; CheckedBy: Mehmet Günce Akkoyun; Author: Mehmet Günce Akkoyun; CompanyName: Ovoo Electronics; DrawnBy: Mehmet Günce Akkoyun; Engineer: Mehmet Günce Akkoyun; Organization: Ovoo Electronics; Address1: Necip Fazýl Mah. Ortaýrmak Sok.; Address2: Birgül Apt. No: 19/6; Address3: Meram / Konya; Address4: Turkiye; DocumentNumber: 23; Revision: R06; SheetNumber: 23; SheetTotal: 54
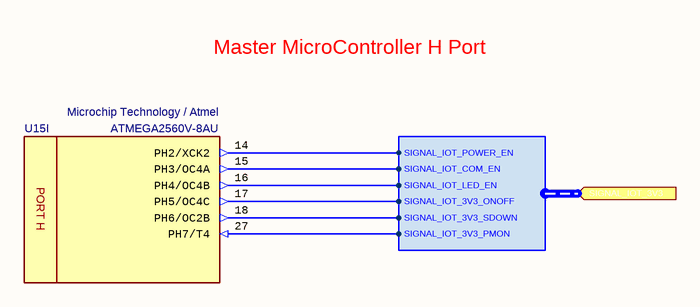
[diagram p18: Master MicroController Port H.SchDoc]

### Parts
U15  Manufacturer_Part_Number: ATMEGA2560V-8AU  Manufacturer_Name: Microchip Technology / Atmel  [TQFP100]  (hidden comment: 8-bit MicroController)  (part I of 15)

### Ports
SIGNAL_IOT_3V3 (in, harness SIGNAL_IOT_3V3)

### Harnesses
SIGNAL_IOT_3V3: SIGNAL_IOT_COM_EN, SIGNAL_IOT_POWER_EN, SIGNAL_IOT_LED_EN, SIGNAL_IOT_3V3_SDOWN, SIGNAL_IOT_3V3_ONOFF, SIGNAL_IOT_3V3_PMON

### Nets
SIGNAL_IOT_3V3.SIGNAL_IOT_3V3_ONOFF: U15.17(PH5/OC4C) ; port SIGNAL_IOT_3V3.SIGNAL_IOT_3V3_ONOFF
SIGNAL_IOT_3V3.SIGNAL_IOT_3V3_PMON: U15.27(PH7/T4) ; port SIGNAL_IOT_3V3.SIGNAL_IOT_3V3_PMON
SIGNAL_IOT_3V3.SIGNAL_IOT_3V3_SDOWN: U15.18(PH6/OC2B) ; port SIGNAL_IOT_3V3.SIGNAL_IOT_3V3_SDOWN
SIGNAL_IOT_3V3.SIGNAL_IOT_COM_EN: U15.15(PH3/OC4A) ; port SIGNAL_IOT_3V3.SIGNAL_IOT_COM_EN
SIGNAL_IOT_3V3.SIGNAL_IOT_LED_EN: U15.16(PH4/OC4B) ; port SIGNAL_IOT_3V3.SIGNAL_IOT_LED_EN
SIGNAL_IOT_3V3.SIGNAL_IOT_POWER_EN: U15.14(PH2/XCK2) ; port SIGNAL_IOT_3V3.SIGNAL_IOT_POWER_EN

### Notes on the sheet
- Master MicroController H Port
- Engineer
- All Rights are reserved to Customer and Engineer. [2021]
- Size:
- Date:
- A4
- Project :
- Time:
- Sheet
- of
- Customer
- Product ID
- Module ID
- Version
- File:
- Revision
- (in symbol IC - ATMEGA2560V-8AU, part I) PORT H

### Library data of the parts
U15 = IC - ATMEGA2560V-8AU: as U15 on sheet Master MicroController Core; Height: 1mm; Mouser_Part_Number: 556-ATMEGA2560V8AU; ComponentLink1Description: DataSheet; ComponentLink1URL: https://eu.mouser.com/datasheet/2/268/Atmel-2549-8-bit-AVR-Microcontroller-ATmega640-128-1315286.pdf; ROHS: Yes; Minimum Operating Temperature: -40; Maximum Operating Temperature: +85; ComponentLink2Description: Mouser; ComponentLink2URL: https://eu.mouser.com/ProductDetail/Microchip-Technology-Atmel/ATMEGA2560V-8AU?qs=sGAEpiMZZMutXGli8Ay4kKlCYcvZUWqJYdtgGFyqFT8%3D; Supplier 1: Mouser; Supplier 2: Arrow; Supplier 3: Farnell; Supplier 4: Newark; Supplier 5: Digi-Key; Supplier Part Number 1: 556-ATMEGA2560V8AU; Supplier Part Number 2: ATMEGA2560V-8AU; Supplier Part Number 3: 1288331; Supplier Part Number 4: 68T2784; Supplier Part Number 5: ATMEGA2560V-8AU-ND; Case: TQFP-100

## Sheet Master MicroController Port K.SchDoc: Master Micro Controller Port K Pin Out
size A4; ApprovedBy: Mehmet Günce Akkoyun; CheckedBy: Mehmet Günce Akkoyun; Author: Mehmet Günce Akkoyun; CompanyName: Ovoo Electronics; DrawnBy: Mehmet Günce Akkoyun; Engineer: Mehmet Günce Akkoyun; Organization: Ovoo Electronics; Address1: Necip Fazýl Mah. Ortaýrmak Sok.; Address2: Birgül Apt. No: 19/6; Address3: Meram / Konya; Address4: Turkiye; DocumentNumber: 25; Revision: R06; SheetNumber: 25; SheetTotal: 54
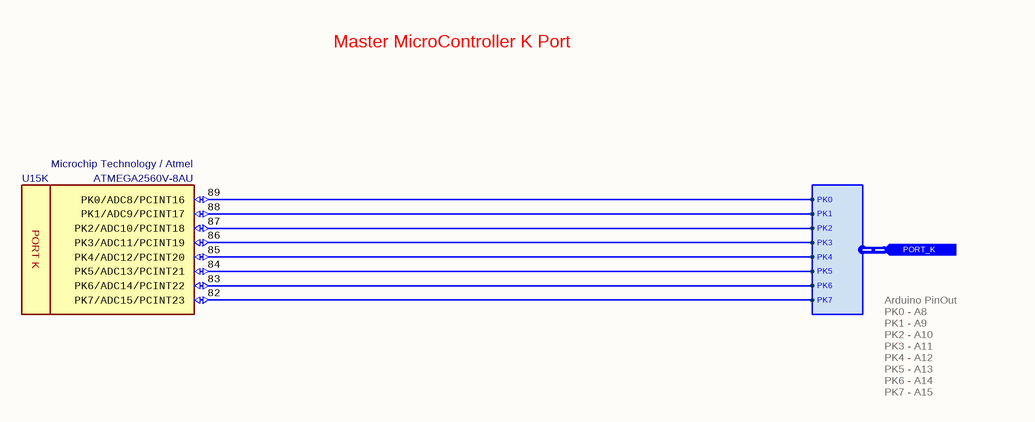
[diagram p19: Master MicroController Port K.SchDoc]

### Parts
U15  Manufacturer_Part_Number: ATMEGA2560V-8AU  Manufacturer_Name: Microchip Technology / Atmel  [TQFP100]  (hidden comment: 8-bit MicroController)  (part K of 15)

### Ports
PORT_K (in, harness PORT_K)

### Harnesses
PORT_K: PK0, PK1, PK2, PK3, PK4, PK5, PK7, PK6

### Nets
PORT_K.PK0: U15.89(PK0/ADC8/PCINT16) ; port PORT_K.PK0
PORT_K.PK1: U15.88(PK1/ADC9/PCINT17) ; port PORT_K.PK1
PORT_K.PK2: U15.87(PK2/ADC10/PCINT18) ; port PORT_K.PK2
PORT_K.PK3: U15.86(PK3/ADC11/PCINT19) ; port PORT_K.PK3
PORT_K.PK4: U15.85(PK4/ADC12/PCINT20) ; port PORT_K.PK4
PORT_K.PK5: U15.84(PK5/ADC13/PCINT21) ; port PORT_K.PK5
PORT_K.PK6: U15.83(PK6/ADC14/PCINT22) ; port PORT_K.PK6
PORT_K.PK7: U15.82(PK7/ADC15/PCINT23) ; port PORT_K.PK7

### Notes on the sheet
- Master MicroController K Port
- Arduino PinOut
  PK0 - A8
  PK1 - A9
  PK2 - A10
  PK3 - A11
  PK4 - A12
  PK5 - A13
  PK6 - A14
  PK7 - A15
- Engineer
- All Rights are reserved to Customer and Engineer. [2021]
- Size:
- Date:
- A4
- Project :
- Time:
- Sheet
- of
- Customer
- Product ID
- Module ID
- Version
- File:
- Revision
- (in symbol IC - ATMEGA2560V-8AU, part K) PORT K

### Library data of the parts
U15 = IC - ATMEGA2560V-8AU: 8-bit Microcontrollers - MCU 256kB Flash 4kB EEPROM 86 I/O Pins; Supply Voltage - Min: 2V7; Supply Voltage - Max: 5.5V; Height: 1mm; Mouser_Part_Number: 556-ATMEGA2560V8AU; ComponentLink1Description: DataSheet; ComponentLink1URL: https://eu.mouser.com/datasheet/2/268/Atmel-2549-8-bit-AVR-Microcontroller-ATmega640-128-1315286.pdf; ROHS: Yes; Minimum Operating Temperature: -40; Maximum Operating Temperature: +85; ComponentLink2Description: Mouser; ComponentLink2URL: https://eu.mouser.com/ProductDetail/Microchip-Technology-Atmel/ATMEGA2560V-8AU?qs=sGAEpiMZZMutXGli8Ay4kKlCYcvZUWqJYdtgGFyqFT8%3D; Supplier 1: Mouser; Supplier 2: Arrow; Supplier 3: Farnell; Supplier 4: Newark; Supplier 5: Digi-Key; Supplier Part Number 1: 556-ATMEGA2560V8AU; Supplier Part Number 2: ATMEGA2560V-8AU; Supplier Part Number 3: 1288331; Supplier Part Number 4: 68T2784; Supplier Part Number 5: ATMEGA2560V-8AU-ND; Case: TQFP-100

## Sheet Master MicroController Serial Communication Port.SchDoc: Master MicroController Communication Port Pin Out
size A4; ApprovedBy: Mehmet Günce Akkoyun; CheckedBy: Mehmet Günce Akkoyun; Author: Mehmet Günce Akkoyun; CompanyName: Ovoo Electronics; DrawnBy: Mehmet Günce Akkoyun; Engineer: Mehmet Günce Akkoyun; Organization: Ovoo Electronics; Address1: Necip Fazýl Mah. Ortaýrmak Sok.; Address2: Birgül Apt. No: 19/6; Address3: Meram / Konya; Address4: Turkiye; DocumentNumber: 27; Revision: R06; SheetNumber: 27; SheetTotal: 54
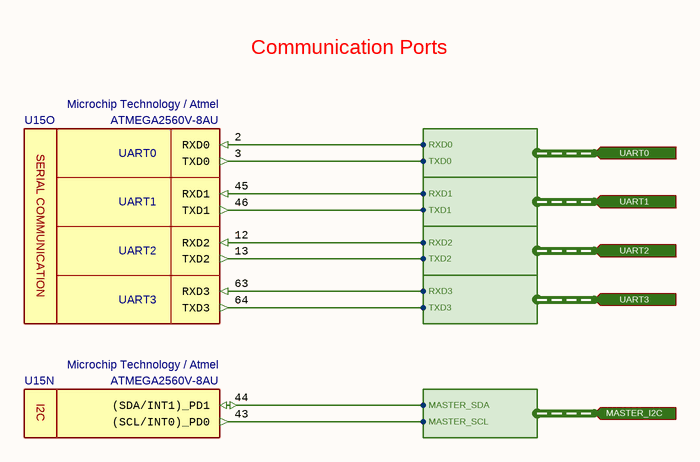
[diagram p20: Master MicroController Serial Communication Port.SchDoc]

### Parts
U15  Manufacturer_Part_Number: ATMEGA2560V-8AU  Manufacturer_Name: Microchip Technology / Atmel  [TQFP100]  (hidden comment: 8-bit MicroController)  (parts N,O of 15)

### Ports
MASTER_I2C (in, harness MASTER_I2C), UART0 (in, harness UART0), UART1 (in, harness UART1), UART2 (in, harness UART2), UART3 (in, harness UART3)

### Harnesses
UART0: RXD0, TXD0
UART1: RXD1, TXD1
UART2: RXD2, TXD2
UART3: RXD3, TXD3
MASTER_I2C: MASTER_SDA, MASTER_SCL

### Nets
MASTER_I2C.MASTER_SCL: U15.43((SCL/INT0)_PD0) ; port MASTER_I2C.MASTER_SCL
MASTER_I2C.MASTER_SDA: U15.44((SDA/INT1)_PD1) ; port MASTER_I2C.MASTER_SDA
UART0.RXD0: U15.2(RXD0) ; port UART0.RXD0
UART0.TXD0: U15.3(TXD0) ; port UART0.TXD0
UART1.RXD1: U15.45(RXD1) ; port UART1.RXD1
UART1.TXD1: U15.46(TXD1) ; port UART1.TXD1
UART2.RXD2: U15.12(RXD2) ; port UART2.RXD2
UART2.TXD2: U15.13(TXD2) ; port UART2.TXD2
UART3.RXD3: U15.63(RXD3) ; port UART3.RXD3
UART3.TXD3: U15.64(TXD3) ; port UART3.TXD3

### Notes on the sheet
- Communication Ports
- Engineer
- All Rights are reserved to Customer and Engineer. [2021]
- Size:
- Date:
- A4
- Project :
- Time:
- Sheet
- of
- Customer
- Product ID
- Module ID
- Version
- File:
- Revision
- (in symbol IC - ATMEGA2560V-8AU, part N) I2C
- (in symbol IC - ATMEGA2560V-8AU, part O) UART0; UART1; SERIAL COMMUNICATION; UART2; UART3

### Library data of the parts
U15 = IC - ATMEGA2560V-8AU: as U15 on sheet Master MicroController Port K; Height: 1mm; Mouser_Part_Number: 556-ATMEGA2560V8AU; ComponentLink1Description: DataSheet; ComponentLink1URL: https://eu.mouser.com/datasheet/2/268/Atmel-2549-8-bit-AVR-Microcontroller-ATmega640-128-1315286.pdf; ROHS: Yes; Minimum Operating Temperature: -40; Maximum Operating Temperature: +85; ComponentLink2Description: Mouser; ComponentLink2URL: https://eu.mouser.com/ProductDetail/Microchip-Technology-Atmel/ATMEGA2560V-8AU?qs=sGAEpiMZZMutXGli8Ay4kKlCYcvZUWqJYdtgGFyqFT8%3D; Supplier 1: Mouser; Supplier 2: Arrow; Supplier 3: Farnell; Supplier 4: Newark; Supplier 5: Digi-Key; Supplier Part Number 1: 556-ATMEGA2560V8AU; Supplier Part Number 2: ATMEGA2560V-8AU; Supplier Part Number 3: 1288331; Supplier Part Number 4: 68T2784; Supplier Part Number 5: ATMEGA2560V-8AU-ND; Case: TQFP-100